# Altium schematic sheet mx25l25645gz2i-08g.SchDoc: NOR
size A4; Date: 10.08.2025; CheckedBy: BCY; DrawnBy: miaow; DocumentNumber: 10; Revision: v0.0.1; SheetNumber: 10; SheetTotal: 12; Sample: A0; Url: github.com/miaow-cn/pcb-lib; Liscense: GPLv3; Board: MIAOW FOC BOARD; BoardType: MAIN_PCB; Desc: qspi nor flash for xip
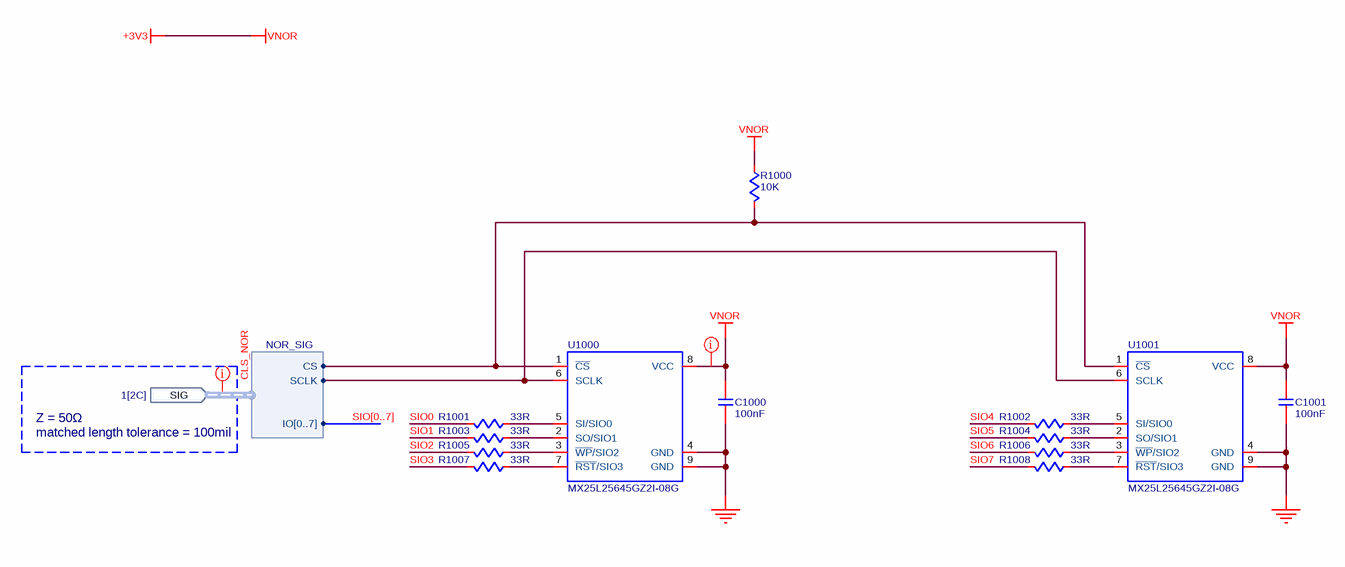
[diagram p0: mx25l25645gz2i-08g.SchDoc]

## Parts
C1000  value 100nF  [C0402]  (hidden comment: C-NOMO)
C1001  value 100nF  [C0402]  (hidden comment: C-NOMO)
R1000  value 10K  [R0402]  (hidden comment: R)
R1001  value 33R  [R0402]  (hidden comment: R)
R1002  value 33R  [R0402]  (hidden comment: R)
R1003  value 33R  [R0402]  (hidden comment: R)
R1004  value 33R  [R0402]  (hidden comment: R)
R1005  value 33R  [R0402]  (hidden comment: R)
R1006  value 33R  [R0402]  (hidden comment: R)
R1007  value 33R  [R0402]  (hidden comment: R)
R1008  value 33R  [R0402]  (hidden comment: R)
U1000  MX25L25645GZ2I-08G  [MX25L25645GZ2I-08G]
U1001  MX25L25645GZ2I-08G  [MX25L25645GZ2I-08G]

## Ports
SIG (in, harness NOR_SIG, see 1[2C])

## Harnesses
NOR_SIG: CS, SCLK, IO[0..7]

## Nets
+3V3: C1000.2 C1001.2 R1000.2 U1000.8(VCC) U1001.8(VCC)  [also labelled VNOR]
GND: C1000.1 C1001.1 U1000.4(GND) U1000.9(GND) U1001.4(GND) U1001.9(GND)
SIO0: R1001.1
SIO1: R1003.1
SIO2: R1005.1
SIO3: R1007.1
SIO4: R1002.1
SIO5: R1004.1
SIO6: R1006.1
SIO7: R1008.1
NetR1000_1: R1000.1 U1000.1(~{CS}) U1001.1(~{CS}) ; port SIG.CS
NetR1001_2: R1001.2 U1000.5(SI/SIO0)
NetR1002_2: R1002.2 U1001.5(SI/SIO0)
NetR1003_2: R1003.2 U1000.2(SO/SIO1)
NetR1004_2: R1004.2 U1001.2(SO/SIO1)
NetR1005_2: R1005.2 U1000.3(~{WP}/SIO2)
NetR1006_2: R1006.2 U1001.3(~{WP}/SIO2)
NetR1007_2: R1007.2 U1000.7(~{RST}/SIO3)
NetR1008_2: R1008.2 U1001.7(~{RST}/SIO3)
NetU1000_6: U1000.6(SCLK) U1001.6(SCLK) ; port SIG.SCLK

## Buses and harness runs
bus SIO[0..7]

## Layout directives
net class CLS_NOR: (no net found under the mark)
net class CLS_PWR: +3V3

## Notes on the sheet
- Z = 50Ω
  matched length tolerance = 100mil
- DRAWN
- CHECKED
- DRAWNBY
- SHEETS
- SHEETS_NO

## Library data of the parts
C1000 C1001 = C-NOMO: voltage: 25V; precision: 5%
R1000-R1008 = R: precision: 1%
U1000 U1001 = MX25L25645GZ2I-08G: Supplier 1: LCSC; Supplier Part Number 1: C2802978